# Altium schematic sheet FMC_Delay_1ns_4Cha.SchDoc: Fine Delay FMC
size 420 x 297 mm; CheckedBy: B. Civel; CompanyName: CERN; DrawnBy: TW, GK; Engineer: TW; Organization: CERN; Address1: European Organization for Nuclear Research; Address2: CH-1211 Geneve 23 - Switzerland; DocumentNumber: 1; Revision: -; SheetNumber: 1; SheetTotal: 10; ModifiedBy: B. Civel; CreateDate: 16/08/2012; CheckedDate: 06/06/2013; EDA_Number: EDA-02267-V6-1; Projet: Fine Delay FMC (FMCDel1ns4cha); Title2: Top Level Diagram; DivGrp: BE-CO; Designer: TW, GK
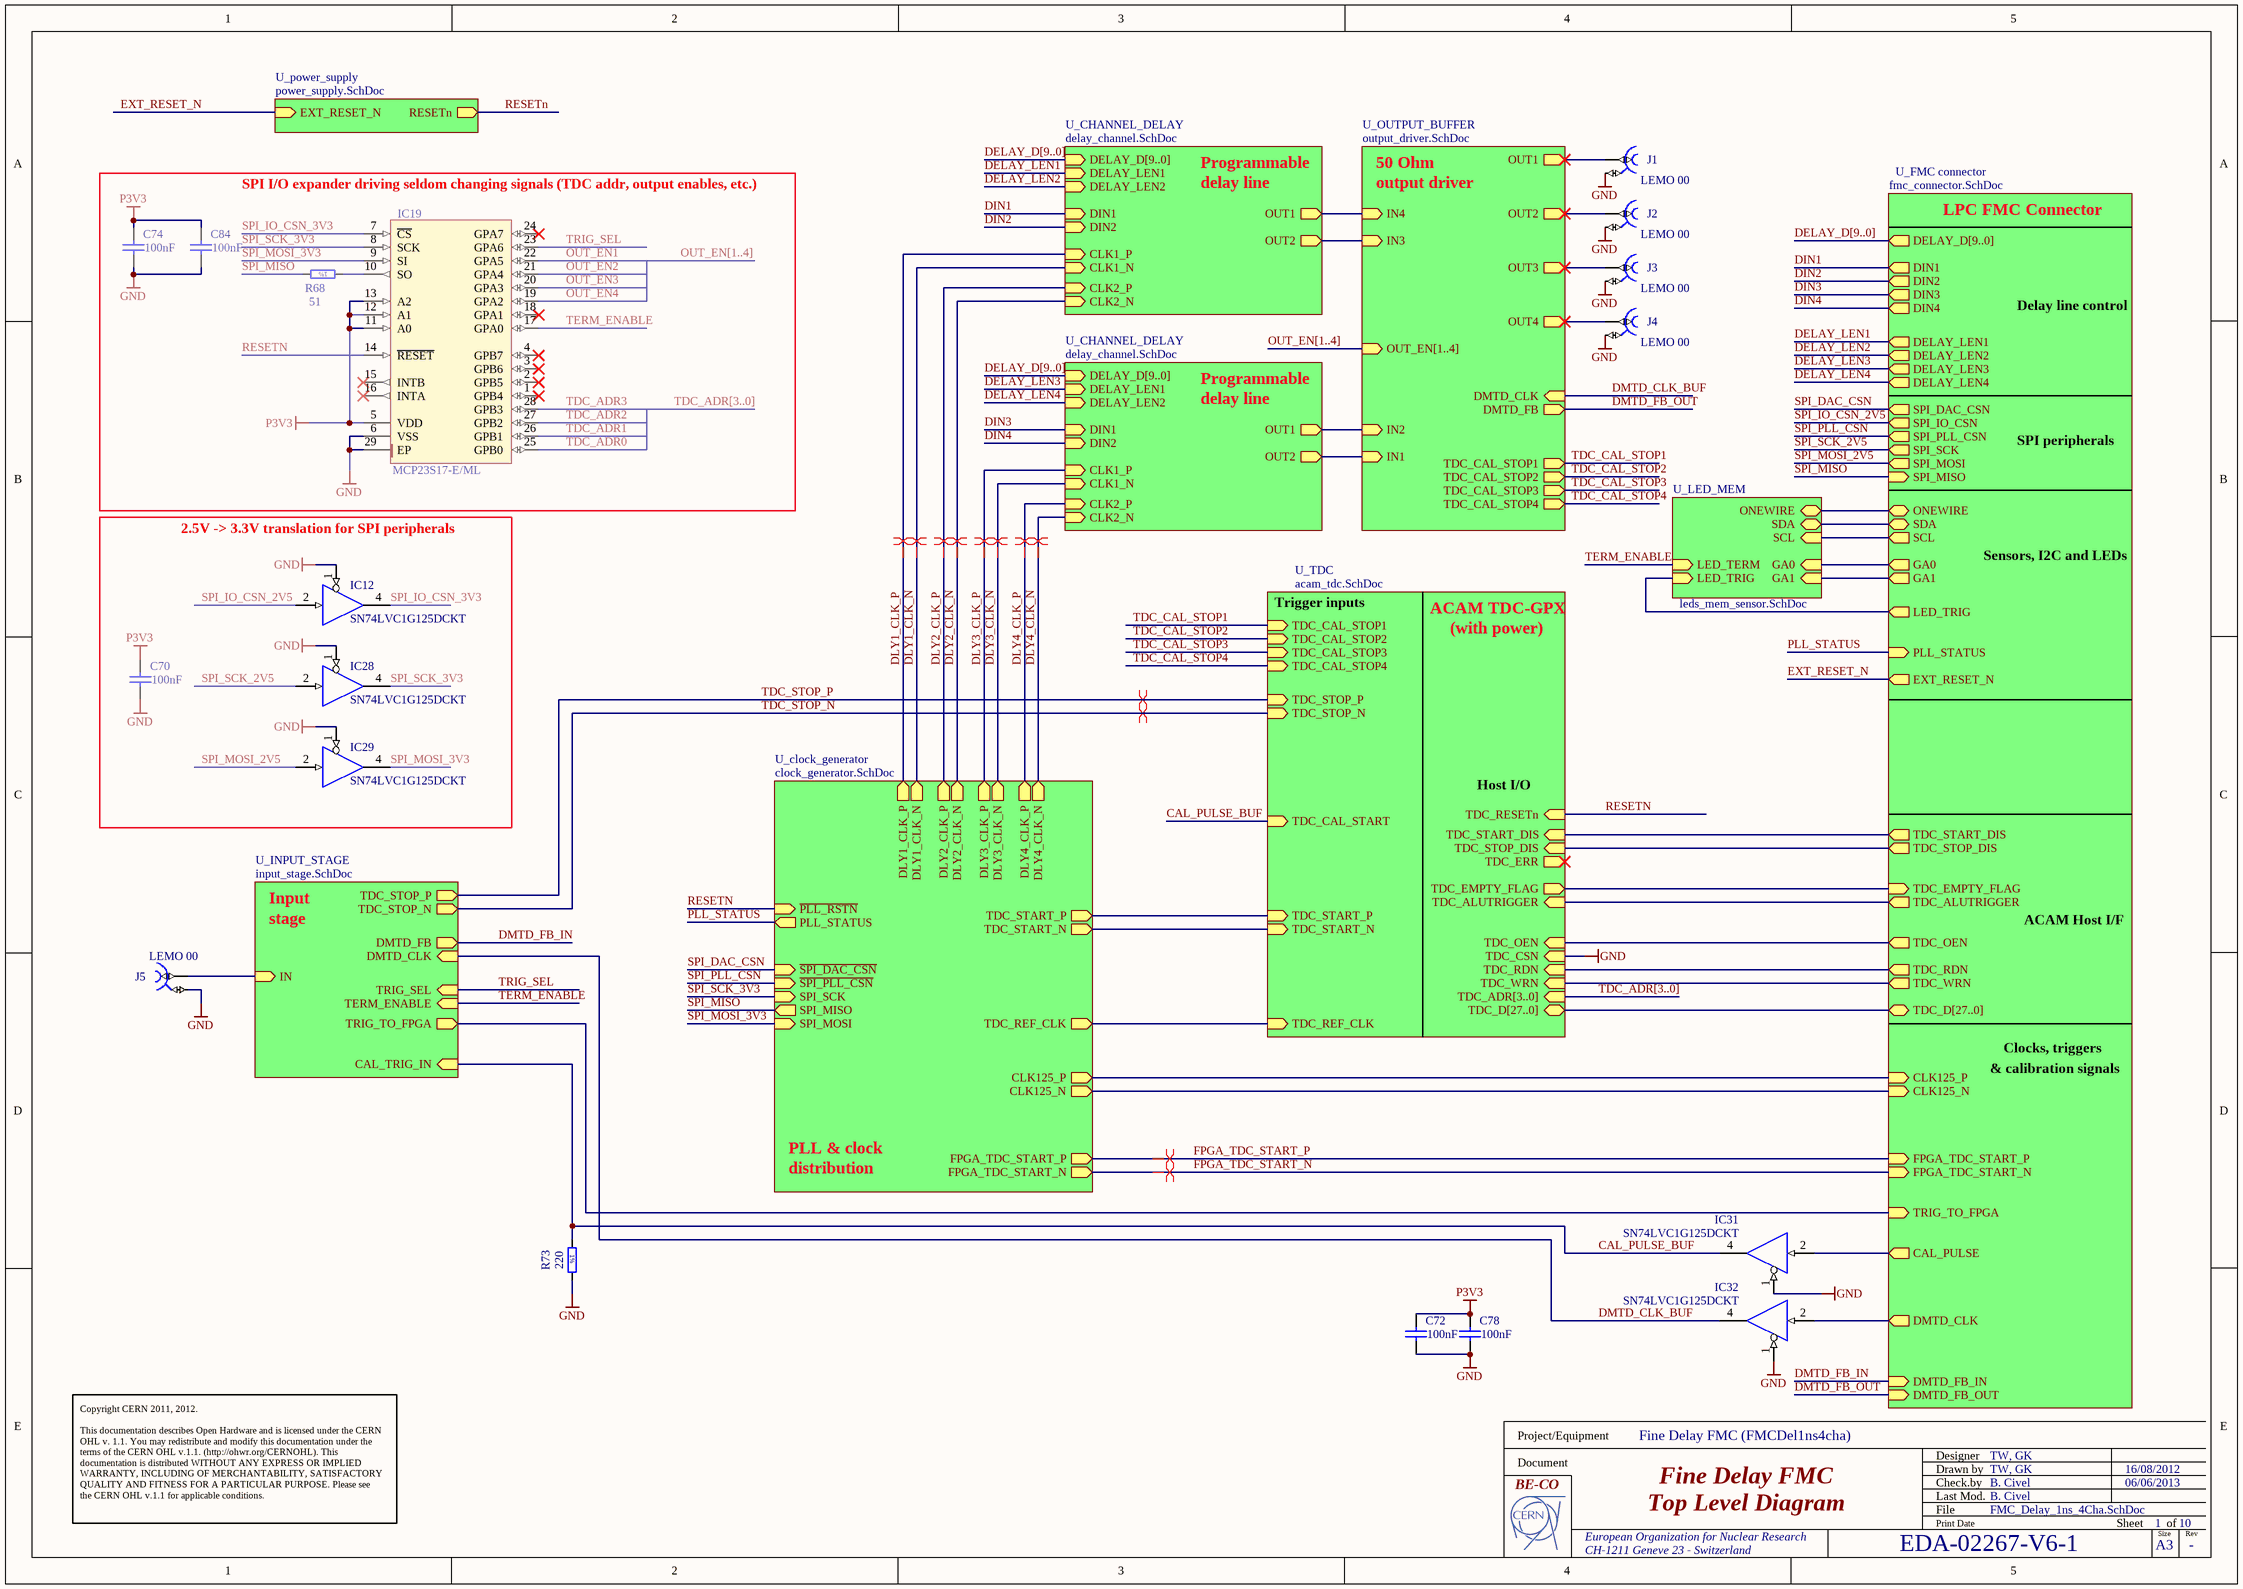
[diagram p0: FMC_Delay_1ns_4Cha.SchDoc]

## Parts
C70  100nF  [CAPC1608X87N]
C72  100nF  [CAPC1608X87N]
C74  100nF  [CAPC1608X87N]
C78  100nF  [CAPC1608X87N]
C84  100nF  [CAPC1608X87N]
IC12  SN74LVC1G125DCKT  [SOT65P210X110-5N]
IC19  MCP23S17-E/ML  [QFN65P600X600X100-29N-S420]
IC28  SN74LVC1G125DCKT  [SOT65P210X110-5N]
IC29  SN74LVC1G125DCKT  [SOT65P210X110-5N]
IC31  SN74LVC1G125DCKT  [SOT65P210X110-5N]
IC32  SN74LVC1G125DCKT  [SOT65P210X110-5N]
J1  LEMO 00  [LEMO_EPK.00.250.NTN]
J2  LEMO 00  [LEMO_EPK.00.250.NTN]
J3  LEMO 00  [LEMO_EPK.00.250.NTN]
J4  LEMO 00  [LEMO_EPK.00.250.NTN]
J5  LEMO 00  [LEMO_EPK.00.250.NTN]
R68  51  [RESC1608X55N]
R73  220  [RESC1608X55N]

## Blocks framed on the sheet
2.5V -> 3.3V translation for SPI peripherals: C70 IC12 IC28 IC29

## Sub-sheets
U_CHANNEL_DELAY = delay_channel.SchDoc: DELAY_D[9..0] (in), DELAY_LEN1 (in), DELAY_LEN2 (in), DIN1 (in), DIN2 (in), OUT1 (out), OUT2 (out), CLK1_P (in), CLK1_N (in), CLK2_N (in), CLK2_P (in)
U_CHANNEL_DELAY = delay_channel.SchDoc: DELAY_D[9..0] (in), DELAY_LEN1 (in), DELAY_LEN2 (in), DIN1 (in), DIN2 (in), OUT1 (out), OUT2 (out), CLK1_P (in), CLK1_N (in), CLK2_N (in), CLK2_P (in)
U_clock_generator = clock_generator.SchDoc: TDC_REF_CLK (out), CLK125_N (out), CLK125_P (out), DLY1_CLK_P (out), DLY1_CLK_N (out), DLY2_CLK_P (out), DLY2_CLK_N (out), DLY3_CLK_P (out), DLY3_CLK_N (out), DLY4_CLK_P (out), DLY4_CLK_N (out), TDC_START_P (out), TDC_START_N (out), FPGA_TDC_START_N (out), FPGA_TDC_START_P (out), PLL_STATUS (out), ~{SPI_PLL_CSN} (in), SPI_SCK (in), SPI_MISO (out), ~{PLL_RSTN} (in), SPI_MOSI (in), ~{SPI_DAC_CSN} (in)
U_FMC connector = fmc_connector.SchDoc: DIN1 (out), DIN2 (out), DIN3 (out), DIN4 (out), TDC_START_DIS (out), TDC_STOP_DIS (out), TDC_EMPTY_FLAG (in), TDC_RDN (out), TDC_WRN (out), TDC_D[27..0] (bidir), DELAY_LEN1 (out), DELAY_LEN2 (out), DELAY_LEN3 (out), DELAY_LEN4 (out), CLK125_P (in), CLK125_N (in), DELAY_D[9..0] (out), SDA (bidir), SCL (out), GA0 (out), GA1 (out), TDC_OEN (out), TDC_ALUTRIGGER (out), FPGA_TDC_START_N (in), FPGA_TDC_START_P (in), ONEWIRE (bidir), LED_TRIG (out), SPI_IO_CSN (out), SPI_MISO (in), SPI_MOSI (out), SPI_PLL_CSN (out), SPI_SCK (out), SPI_DAC_CSN (out), DMTD_CLK (out), DMTD_FB_OUT (in), CAL_PULSE (out), PLL_STATUS (in), TRIG_TO_FPGA (in), DMTD_FB_IN (in), EXT_RESET_N (out)
U_INPUT_STAGE = input_stage.SchDoc: IN (in), TERM_ENABLE (in), TDC_STOP_P (out), TDC_STOP_N (out), TRIG_SEL (in), TRIG_TO_FPGA (out), CAL_TRIG_IN (in), DMTD_FB (out), DMTD_CLK (in)
U_LED_MEM = leds_mem_sensor.SchDoc: SDA (bidir), SCL (in), GA0 (in), GA1 (in), ONEWIRE (bidir), LED_TERM (in), LED_TRIG (in)
U_OUTPUT_BUFFER = output_driver.SchDoc: IN1 (in), IN2 (in), IN3 (in), IN4 (in), OUT1 (out), OUT2 (out), OUT3 (out), OUT4 (out), OUT_EN[1..4] (in), DMTD_FB (out), DMTD_CLK (in), TDC_CAL_STOP1 (out), TDC_CAL_STOP2 (out), TDC_CAL_STOP3 (out), TDC_CAL_STOP4 (out)
U_power_supply = power_supply.SchDoc: RESETn (out), EXT_RESET_N (in)
U_TDC = acam_tdc.SchDoc: TDC_ADR[3..0] (in), TDC_START_P (in), TDC_START_N (in), TDC_START_DIS (in), TDC_STOP_DIS (in), TDC_EMPTY_FLAG (out), TDC_REF_CLK (in), TDC_RESETn (in), TDC_D[27..0] (bidir), TDC_OEN (in), TDC_CSN (in), TDC_RDN (in), TDC_WRN (in), TDC_ERR (out), TDC_STOP_P (in), TDC_STOP_N (in), TDC_ALUTRIGGER (in), TDC_CAL_START (in), TDC_CAL_STOP2 (in), TDC_CAL_STOP3 (in), TDC_CAL_STOP4 (in), TDC_CAL_STOP1 (in)

## Nets
GND: C70.2 C72.2 C74.2 C78.2 C84.2 IC12.1(~{G}) IC12.3(GND) IC19.6(VSS) IC19.29(EP) IC28.1(~{G}) IC28.3(GND) IC29.1(~{G}) IC29.3(GND) IC31.1(~{G}) IC31.3(GND) IC32.1(~{G}) IC32.3(GND) J1.2 J2.2 J3.2 J4.2 J5.2 R73.2 ; sheet U_TDC/TDC_CSN
P3V3: C70.1 C72.1 C74.1 C78.1 C84.1 IC12.5(VCC) IC19.5(VDD) IC19.11(A0) IC19.12(A1) IC19.13(A2) IC28.5(VCC) IC29.5(VCC) IC31.5(VCC) IC32.5(VCC)
CAL_PULSE_BUF: IC31.4(OUT) R73.1 ; sheet U_TDC/TDC_CAL_START, sheet U_INPUT_STAGE/CAL_TRIG_IN
DELAY_LEN1: sheet U_FMC connector/DELAY_LEN1, sheet U_CHANNEL_DELAY/DELAY_LEN1
DELAY_LEN2: sheet U_FMC connector/DELAY_LEN2, sheet U_CHANNEL_DELAY/DELAY_LEN2
DELAY_LEN3: sheet U_FMC connector/DELAY_LEN3, sheet U_CHANNEL_DELAY/DELAY_LEN1
DELAY_LEN4: sheet U_FMC connector/DELAY_LEN4, sheet U_CHANNEL_DELAY/DELAY_LEN2
DIN1: sheet U_FMC connector/DIN1, sheet U_CHANNEL_DELAY/DIN1
DIN2: sheet U_FMC connector/DIN2, sheet U_CHANNEL_DELAY/DIN2
DIN3: sheet U_FMC connector/DIN3, sheet U_CHANNEL_DELAY/DIN1
DIN4: sheet U_FMC connector/DIN4, sheet U_CHANNEL_DELAY/DIN2
DLY1_CLK_N: sheet U_clock_generator/DLY1_CLK_N, sheet U_CHANNEL_DELAY/CLK1_N
DLY1_CLK_P: sheet U_clock_generator/DLY1_CLK_P, sheet U_CHANNEL_DELAY/CLK1_P
DLY2_CLK_N: sheet U_clock_generator/DLY2_CLK_N, sheet U_CHANNEL_DELAY/CLK2_N
DLY2_CLK_P: sheet U_clock_generator/DLY2_CLK_P, sheet U_CHANNEL_DELAY/CLK2_P
DLY3_CLK_N: sheet U_clock_generator/DLY3_CLK_N, sheet U_CHANNEL_DELAY/CLK1_N
DLY3_CLK_P: sheet U_clock_generator/DLY3_CLK_P, sheet U_CHANNEL_DELAY/CLK1_P
DLY4_CLK_N: sheet U_clock_generator/DLY4_CLK_N, sheet U_CHANNEL_DELAY/CLK2_N
DLY4_CLK_P: sheet U_clock_generator/DLY4_CLK_P, sheet U_CHANNEL_DELAY/CLK2_P
DMTD_CLK_BUF: IC32.4(OUT) ; sheet U_OUTPUT_BUFFER/DMTD_CLK, sheet U_INPUT_STAGE/DMTD_CLK
DMTD_FB_IN: sheet U_FMC connector/DMTD_FB_IN, sheet U_INPUT_STAGE/DMTD_FB
DMTD_FB_OUT: sheet U_FMC connector/DMTD_FB_OUT, sheet U_OUTPUT_BUFFER/DMTD_FB
EXT_RESET_N: sheet U_FMC connector/EXT_RESET_N, sheet U_power_supply/EXT_RESET_N
FPGA_TDC_START_N: sheet U_clock_generator/FPGA_TDC_START_N, sheet U_FMC connector/FPGA_TDC_START_N
FPGA_TDC_START_P: sheet U_clock_generator/FPGA_TDC_START_P, sheet U_FMC connector/FPGA_TDC_START_P
OUT_EN1: IC19.22(GPA5)
OUT_EN2: IC19.21(GPA4)
OUT_EN3: IC19.20(GPA3)
OUT_EN4: IC19.19(GPA2)
PLL_STATUS: sheet U_clock_generator/PLL_STATUS, sheet U_FMC connector/PLL_STATUS
RESETn: IC19.14(~{RESET}) ; sheet U_clock_generator/~{PLL_RSTN}, sheet U_power_supply/RESETn, sheet U_TDC/TDC_RESETn
SPI_DAC_CSN: sheet U_clock_generator/~{SPI_DAC_CSN}, sheet U_FMC connector/SPI_DAC_CSN
SPI_IO_CSN_2V5: IC12.2(IN) ; sheet U_FMC connector/SPI_IO_CSN
SPI_IO_CSN_3V3: IC12.4(OUT) IC19.7(~{CS})
SPI_MISO: R68.2 ; sheet U_clock_generator/SPI_MISO, sheet U_FMC connector/SPI_MISO
SPI_MOSI_2V5: IC29.2(IN) ; sheet U_FMC connector/SPI_MOSI
SPI_MOSI_3V3: IC19.9(SI) IC29.4(OUT) ; sheet U_clock_generator/SPI_MOSI
SPI_PLL_CSN: sheet U_clock_generator/~{SPI_PLL_CSN}, sheet U_FMC connector/SPI_PLL_CSN
SPI_SCK_2V5: IC28.2(IN) ; sheet U_FMC connector/SPI_SCK
SPI_SCK_3V3: IC19.8(SCK) IC28.4(OUT) ; sheet U_clock_generator/SPI_SCK
TDC_ADR0: IC19.25(GPB0)
TDC_ADR1: IC19.26(GPB1)
TDC_ADR2: IC19.27(GPB2)
TDC_ADR3: IC19.28(GPB3)
TDC_CAL_STOP1: sheet U_TDC/TDC_CAL_STOP1, sheet U_OUTPUT_BUFFER/TDC_CAL_STOP1
TDC_CAL_STOP2: sheet U_TDC/TDC_CAL_STOP2, sheet U_OUTPUT_BUFFER/TDC_CAL_STOP2
TDC_CAL_STOP3: sheet U_TDC/TDC_CAL_STOP3, sheet U_OUTPUT_BUFFER/TDC_CAL_STOP3
TDC_CAL_STOP4: sheet U_TDC/TDC_CAL_STOP4, sheet U_OUTPUT_BUFFER/TDC_CAL_STOP4
TDC_STOP_N: sheet U_TDC/TDC_STOP_N, sheet U_INPUT_STAGE/TDC_STOP_N
TDC_STOP_P: sheet U_TDC/TDC_STOP_P, sheet U_INPUT_STAGE/TDC_STOP_P
TERM_ENABLE: IC19.17(GPA0) ; sheet U_INPUT_STAGE/TERM_ENABLE, sheet U_LED_MEM/LED_TERM
TRIG_SEL: IC19.23(GPA6) ; sheet U_INPUT_STAGE/TRIG_SEL
NetIC19_10: IC19.10(SO) R68.1
NetIC31_2: IC31.2(IN) ; sheet U_FMC connector/CAL_PULSE
NetIC32_2: IC32.2(IN) ; sheet U_FMC connector/DMTD_CLK
NetJ1_1: J1.1 ; sheet U_OUTPUT_BUFFER/OUT1
NetJ2_1: J2.1 ; sheet U_OUTPUT_BUFFER/OUT2
NetJ3_1: J3.1 ; sheet U_OUTPUT_BUFFER/OUT3
NetJ4_1: J4.1 ; sheet U_OUTPUT_BUFFER/OUT4
NetJ5_1: J5.1 ; sheet U_INPUT_STAGE/IN
(unnamed): sheet U_clock_generator/TDC_REF_CLK, sheet U_TDC/TDC_REF_CLK
(unnamed): sheet U_clock_generator/CLK125_N, sheet U_FMC connector/CLK125_N
(unnamed): sheet U_clock_generator/CLK125_P, sheet U_FMC connector/CLK125_P
(unnamed): sheet U_clock_generator/TDC_START_P, sheet U_TDC/TDC_START_P
(unnamed): sheet U_clock_generator/TDC_START_N, sheet U_TDC/TDC_START_N
(unnamed): sheet U_FMC connector/TDC_START_DIS, sheet U_TDC/TDC_START_DIS
(unnamed): sheet U_FMC connector/TDC_STOP_DIS, sheet U_TDC/TDC_STOP_DIS
(unnamed): sheet U_FMC connector/TDC_EMPTY_FLAG, sheet U_TDC/TDC_EMPTY_FLAG
(unnamed): sheet U_FMC connector/TDC_RDN, sheet U_TDC/TDC_RDN
(unnamed): sheet U_FMC connector/TDC_WRN, sheet U_TDC/TDC_WRN
(unnamed): sheet U_FMC connector/SDA, sheet U_LED_MEM/SDA
(unnamed): sheet U_FMC connector/SCL, sheet U_LED_MEM/SCL
(unnamed): sheet U_FMC connector/GA0, sheet U_LED_MEM/GA0
(unnamed): sheet U_FMC connector/GA1, sheet U_LED_MEM/GA1
(unnamed): sheet U_FMC connector/TDC_OEN, sheet U_TDC/TDC_OEN
(unnamed): sheet U_FMC connector/TDC_ALUTRIGGER, sheet U_TDC/TDC_ALUTRIGGER
(unnamed): sheet U_FMC connector/ONEWIRE, sheet U_LED_MEM/ONEWIRE
(unnamed): sheet U_FMC connector/LED_TRIG, sheet U_LED_MEM/LED_TRIG
(unnamed): sheet U_FMC connector/TRIG_TO_FPGA, sheet U_INPUT_STAGE/TRIG_TO_FPGA
(unnamed): sheet U_CHANNEL_DELAY/OUT1, sheet U_OUTPUT_BUFFER/IN4
(unnamed): sheet U_CHANNEL_DELAY/OUT2, sheet U_OUTPUT_BUFFER/IN3
(unnamed): sheet U_CHANNEL_DELAY/OUT1, sheet U_OUTPUT_BUFFER/IN2
(unnamed): sheet U_CHANNEL_DELAY/OUT2, sheet U_OUTPUT_BUFFER/IN1

Not connected (* = marked no-connect by the designer): IC19 1(GPB4)* 2(GPB5)* 3(GPB6)* 4(GPB7)* 15(INTB)* 16(INTA)* 18(GPA1)* 24(GPA7)*

## Buses and harness runs
bus DELAY_D[9..0] = sheet U_CHANNEL_DELAY/DELAY_D[9..0]
bus DELAY_D[9..0] = sheet U_FMC connector/DELAY_D[9..0]
bus OUT_EN[1..4]
bus OUT_EN[1..4] = sheet U_OUTPUT_BUFFER/OUT_EN[1..4]
bus sheet U_FMC connector/TDC_D[27..0] = sheet U_TDC/TDC_D[27..0]
bus TDC_ADR[3..0]
bus TDC_ADR[3..0] = sheet U_TDC/TDC_ADR[3..0]

## Layout directives
differential pair: DLY1_CLK_N, DLY1_CLK_P, DLY2_CLK_N, DLY2_CLK_P, DLY3_CLK_N, DLY3_CLK_P, DLY4_CLK_N, DLY4_CLK_P, FPGA_TDC_START_N, FPGA_TDC_START_P, TDC_STOP_N, TDC_STOP_P

## Notes on the sheet
- SPI I/O expander driving seldom changing signals (TDC addr, output enables, etc.)
- Programmable
- delay line
- 50 Ohm
- output driver
- LPC FMC Connector
- Delay line control
- SPI peripherals
- Sensors, I2C and LEDs
- Trigger inputs
- ACAM TDC-GPX
- (with power)
- Host I/O
- Input
- stage
- ACAM Host I/F
- & calibration signals
- Clocks, triggers
- PLL & clock
- distribution
- Copyright CERN 2011, 2012.
  This documentation describes Open Hardware and is licensed under the CERN OHL v. 1.1. You may redistribute and modify this documentation under the terms of the CERN OHL v.1.1. (http://ohwr.org/CERNOHL). This documentation is distributed WITHOUT ANY EXPRESS OR IMPLIED WARRANTY, INCLUDING OF MERCHANTABILITY, SATISFACTORY QUALITY AND FITNESS FOR A PARTICULAR PURPOSE. Please see the CERN OHL v.1.1 for applicable conditions.
- Project/Equipment
- Document
- Designer
- Drawn by
- Check.by
- File
- Last Mod.
- Print Date
- Sheet
- Size
- A3
- of
- Rev
- (in symbol R0603_51R_1%_0.1W_100PPM) 1%
- (in symbol R0603_220R_1%_0.1W_100PPM) 1%

## Library data of the parts
C70 C72 C74 C78 C84 = CC0603_100NF_50V_10%_X7R: Non-polarised capacitor; Manufacturer1 Part Number: 223858615649; Manufacturer: GENERIC; Part Description: SMD Multilayer Chip Ceramic Capacitor; Table: Capacitors SMD; TC: X7R; Tolerance: ±10%; Voltage: 50V; Author: CERN DEM JLC; Case: 0603; Component Type: Standard; CreateDate: 03/12/2007; HelpURL: \\cern.ch\dfs\Applications\Altium\Datasheets\CC0603_X7R_PHYCOMP.pdf; LatestRevisionDate: 03/12/2007; Manufacturer1 ComponentHeight: 0.87mm; Manufacturer1 Example: PHYCOMP; Manufacturer Part Number: CC0603_100NF_50V_10%_X7R; Mounted: Yes; Pin Count: 2; SMD: Yes; Socket: No; Status: Preferred; Value: 100nF; Part Number: CC0603_100NF_50V_10%_X7R; Component Kind: Standard
IC12 IC28 IC29 IC31 IC32 = SN74LVC1G125DCKT: Single Bus Buffer Gate With 3-State Output; Manufacturer: TEXAS INSTRUMENTS; Table: Standard Logic; PressFit: No; Bonding: No; Part Number: SN74LVC1G125DCKT; Component Kind: Standard; Component Type: Standard; Device: SN74LVC1G125DCKT; PackageDescription: SOT353, SC70-5, SOT, 0.65mm Pitch, 5 pin, 1.25mm W X 2.00mm L X 1.10mm H, IPC Medium Density; Part Description: Single Bus Buffer Gate With 3-State Output; Manufacturer Part Number: SN74LVC1G125DCKT; Pin Count: 5; Case: SOT353; Mounted: Yes; Socket: No; SMD: Yes; ComponentHeight: 1.1mm; Author: CERN DEM JLC; HelpURL: \\cern.ch\dfs\Applications\Altium\Datasheets\SN74LVC1G125DCKT.pdf; CreateDate: 19/12/2011; LatestRevisionDate: 19/12/2011
IC19 = MCP23S17-E/ML: 16-bit I/O Port Expander With Serial Interface; Manufacturer: MICROCHIP TECHNOLOGY; Table: Analog & Interface; PressFit: No; Bonding: No; Part Number: MCP23S17-E/ML; Component Kind: Standard; Component Type: Standard; Device: MCP23S17-E/ML; PackageDescription: QFN, 0.65mm pitch, square; 28 pin, 6.00mm L X 6.00mm W X 1.00mm H body (w/thermal tab 4.2mm x 4.2mm), IPC Medium Density; Part Description: 16-bit I/O Port Expander With Serial Interface; Manufacturer Part Number: MCP23S17-E/ML; Pin Count: 29; Case: QFN28; Mounted: Yes; Socket: No; SMD: Yes; ComponentHeight: 1mm; Author: CERN DEM JLC; HelpURL: \\cern.ch\dfs\Applications\Altium\Datasheets\MCP23S17-E-ML.pdf; CreateDate: 11/05/2010; LatestRevisionDate: 11/05/2010
J1-J5 = LEMO_EPK.00.250.NTN: Part Description: Size 00, 50 Ohms Coaxial Elbow (90°) socket With Clearance Under The Body; SCEM: 09.46.11.180.6; PressFit: No; Part Number: LEMO_EPK.00.250.NTN; Component Kind: Standard; Component Type: Standard; Pin Count: 2; Family: LEMO 00; Mounted: Yes; Socket: No; SMD: No; Status: None; Manufacturer: LEMO; Manufacturer Part Number: EPK.00.250.NTN; ComponentHeight: 7mm; HelpURL: \\cern.ch\dfs\Applications\Altium\Datasheets\LEMO_EPK.00.250.NTN.pdf; Author: CERN DEM JLC; CreateDate: 04/09/2012; LatestRevisionDate: 04/09/2012; Table: LEMO
R68 = R0603_51R_1%_0.1W_100PPM: Resistor - 1%; Part Description: General Purpose Thick Film Chip Resistor; Manufacturer: GENERIC; Manufacturer1 Part Number: NRC06F51R0TRF; Power: 0.1W; TC: ±100ppm/°C; Table: Resistors SMD; Part Number: R0603_51R_1%_0.1W_100PPM; Component Kind: Standard; Component Type: Standard; Pin Count: 2; Value: 51; Status: Preferred; Tolerance: ±1%; Manufacturer Part Number: R0603_51R_1%_0.1W_100PPM; Case: 0603; Mounted: Yes; Socket: No; SMD: Yes; Manufacturer1 Example: NIC COMPONENT; Manufacturer1 ComponentHeight: 0.55mm; HelpURL: \\cern.ch\dfs\Applications\Altium\Datasheets\R0603_NIC_NRC.pdf; Author: CERN DEM JLC; CreateDate: 12/3/2007; LatestRevisionDate: 3/13/2008
R73 = R0603_220R_1%_0.1W_100PPM: Resistor - 1%; Part Description: General Purpose Thick Film Chip Resistor; Manufacturer: GENERIC; Manufacturer1 Part Number: NRC06F2200TRF; Power: 0.1W; TC: ±100ppm/°C; Table: Resistors SMD; Part Number: R0603_220R_1%_0.1W_100PPM; Component Kind: Standard; Component Type: Standard; Pin Count: 2; Value: 220; Status: Preferred; Tolerance: ±1%; Manufacturer Part Number: R0603_220R_1%_0.1W_100PPM; Case: 0603; Mounted: Yes; Socket: No; SMD: Yes; Manufacturer1 Example: NIC COMPONENT; Manufacturer1 ComponentHeight: 0.55mm; HelpURL: \\cern.ch\dfs\Applications\Altium\Datasheets\R0603_NIC_NRC.pdf; Author: CERN DEM JLC; CreateDate: 12/3/2007; LatestRevisionDate: 3/13/2008